# Altium project Mach do dong.PrjPcb
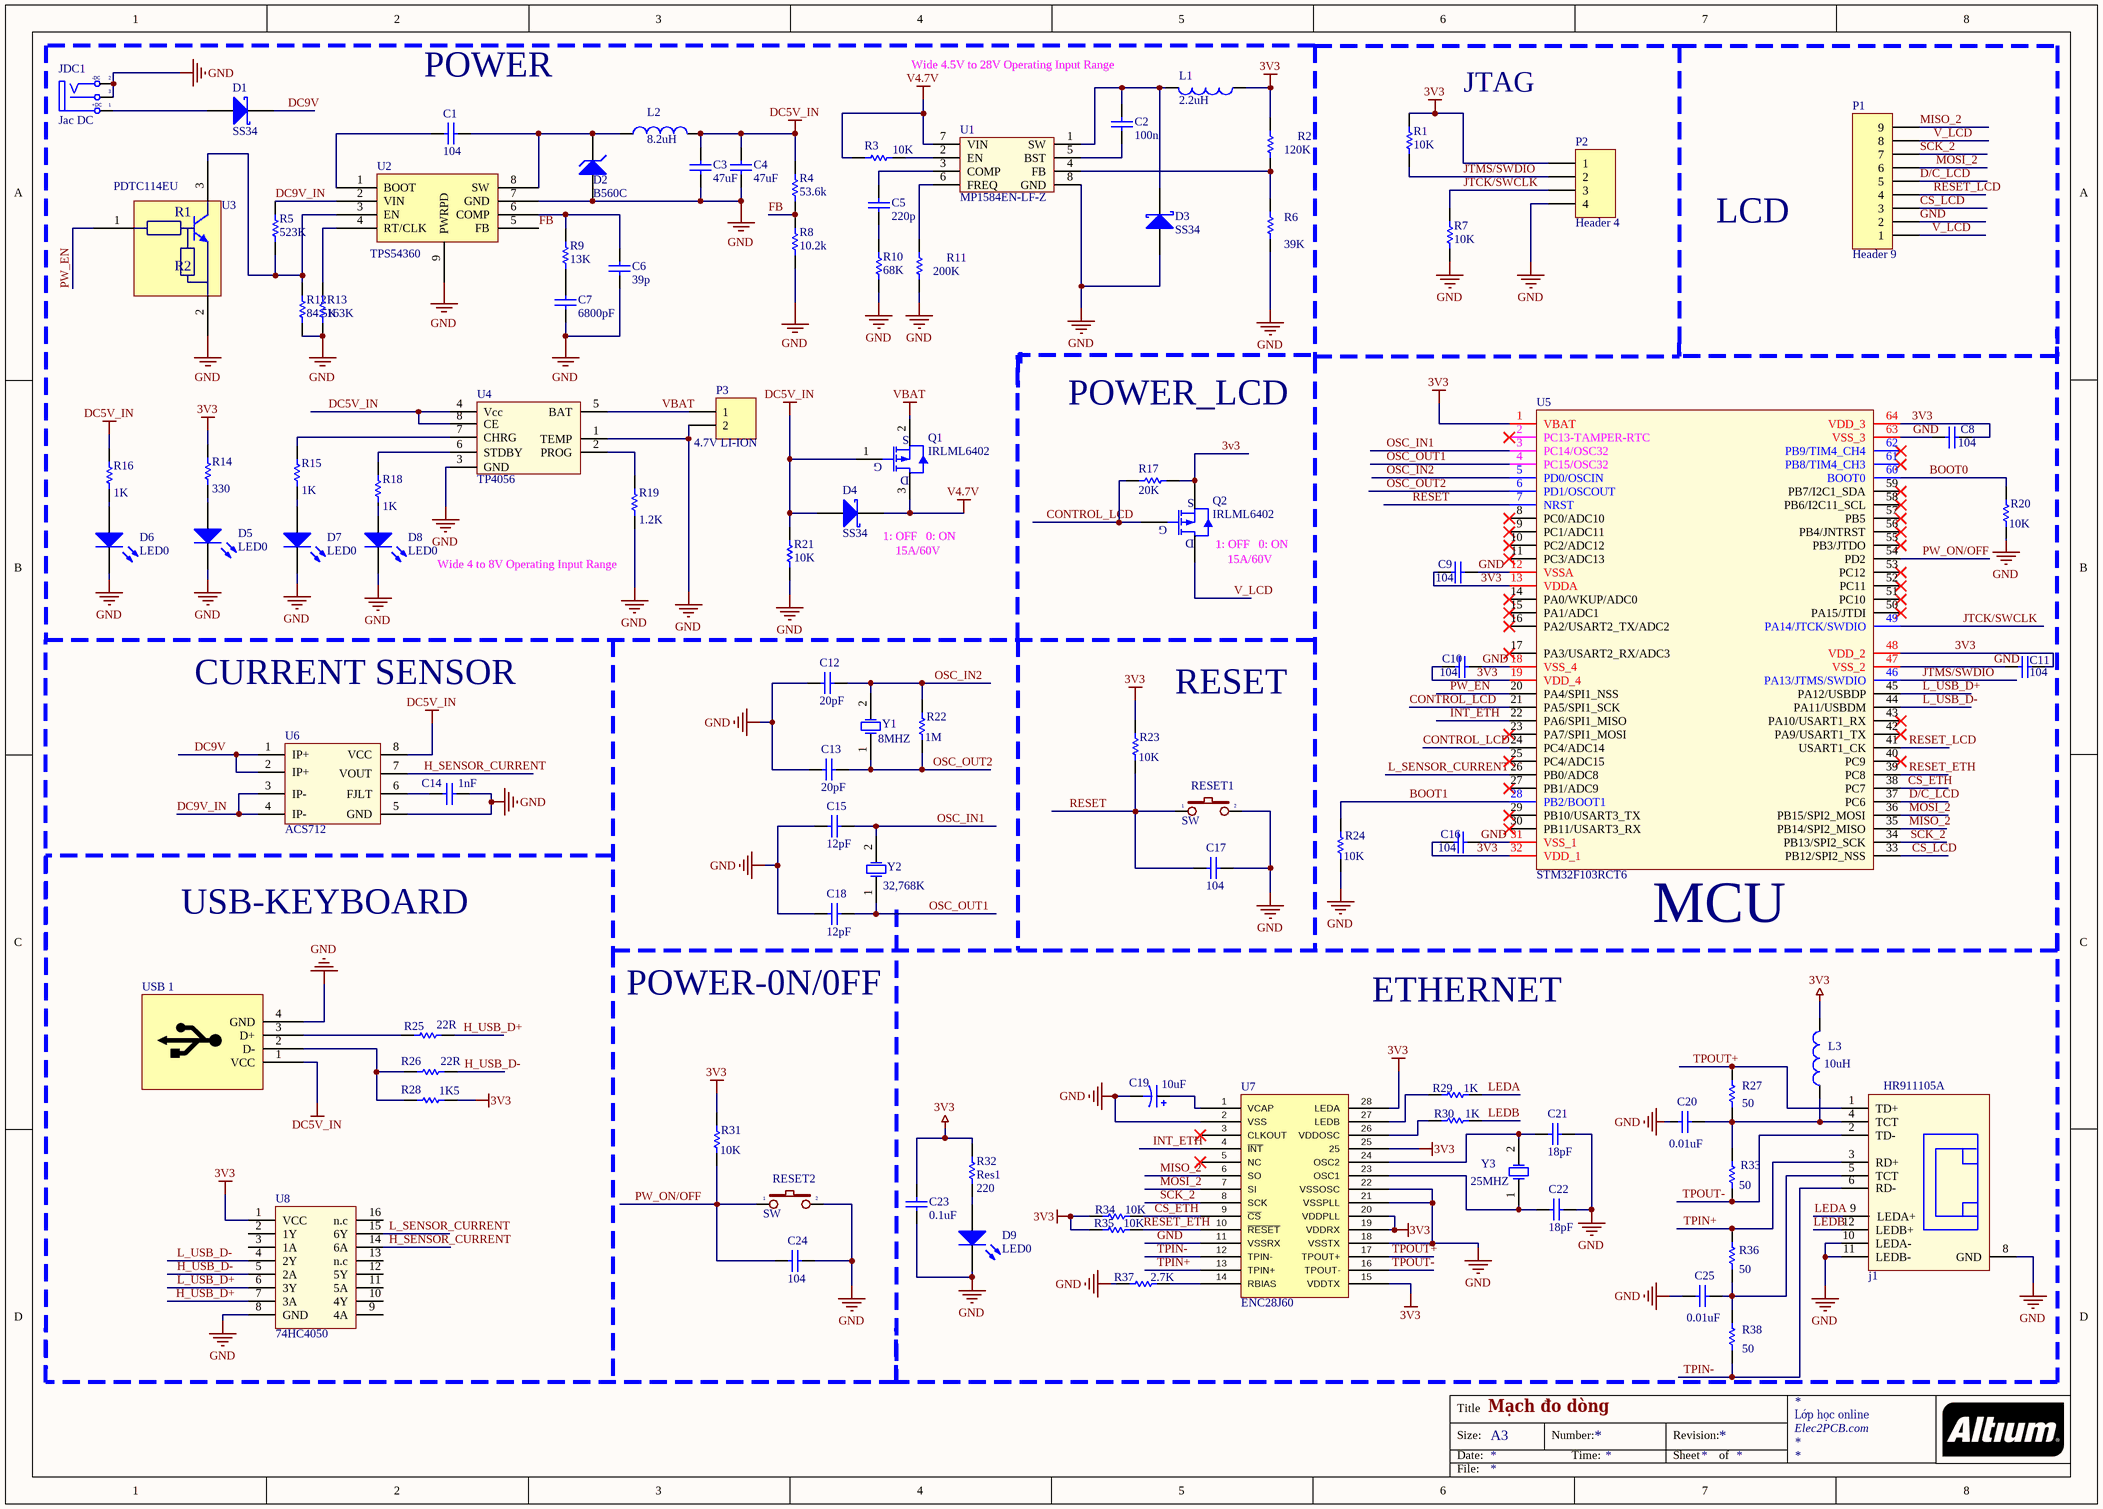
[diagram p0: Mach do dong.schdoc]
1 sheet, 96 parts. Net scope: global (net labels, ports and power ports of the same name join across sheets).
Board file: Mach do dong unroute.PcbDoc

## Sheet Mach do dong.schdoc: Mạch đo dòng
size A3; Address1: Lớp học online; Address2: Elec2PCB.com

### Parts
C1  value 104  [RESC2012(0805)]  (hidden comment: Cap)
C2  value 100n  [C0805-2012]  (hidden comment: Cap)
C3  value 47uF  [RESC2012(0805)]  (hidden comment: Cap)
C4  value 47uF  [RESC2012(0805)]  (hidden comment: Cap)
C5  value 220p  [C0805-2012]  (hidden comment: Cap)
C6  value 39p  [RESC2012(0805)]  (hidden comment: Cap)
C7  value 6800pF  [RESC2012(0805)]  (hidden comment: Cap)
C8  value 104  [C0805-2012]  (hidden comment: Cap)
C9  value 104  [C0805-2012]  (hidden comment: Cap)
C10  value 104  [C0805-2012]  (hidden comment: Cap)
C11  value 104  [C0805-2012]  (hidden comment: Cap)
C12  value 20pF  [C0805-2012]  (hidden comment: Cap)
C13  value 20pF  [C0805-2012]  (hidden comment: Cap)
C14  value 1nF  [C0805-2012]  (hidden comment: Cap)
C15  value 12pF  [C0805-2012]  (hidden comment: Cap)
C16  value 104  [C0805-2012]  (hidden comment: Cap)
C17  value 104  [C0805-2012]  (hidden comment: Cap)
C18  value 12pF  [C0805-2012]  (hidden comment: Cap)
C19  value 10uF  [CAP_TANTA_10UF_10V]  (hidden comment: Cap Pol1)
C20  value 0.01uF  [C0805-2012]  (hidden comment: Cap)
C21  value 18pF  [C0805-2012]  (hidden comment: Cap)
C22  value 18pF  [C0805-2012]  (hidden comment: Cap)
C23  value 0.1uF  [C0805-2012]  (hidden comment: Cap)
C24  value 104  [C0805-2012]  (hidden comment: Cap)
C25  value 0.01uF  [C0805-2012]  (hidden comment: Cap)
D1  SS34  [SS14]
D2  B560C  [SS34]
D3  SS34  [SS14]
D4  SS34  [SS14]
D5  LED0  [RESC2012(0805)]
D6  LED0  [RESC2012(0805)]
D7  LED0  [RESC2012(0805)]
D8  LED0  [RESC2012(0805)]
D9  LED0  [RESC2012(0805)]
j1  HR911105A  [HR911105A]
JDC1  Jac DC  [DC-IN]
L1  value 2.2uH  [CD32 - 2.2uH 3.5x3.3MM]  (hidden comment: Inductor)
L2  value 8.2uH  [L-8.2uH CD53 SMD]  (hidden comment: Inductor)
L3  value 10uH  [INDUCTOR_TOKO_1UH]  (hidden comment: Inductor)
P1  Header 9  [CON9]
P2  Header 4  [Header_4]
P3  4.7V LI-ION  [Header_2]
Q1  IRLML6402  [SOT-23_M]
Q2  IRLML6402  [SOT-23_M]
R1  value 10K  [RESC2012(0805)]  (hidden comment: Res1)
R2  value 120K  [RESC2012(0805)]  (hidden comment: Res1)
R3  value 10K  [RESC2012(0805)]  (hidden comment: Res1)
R4  value 53.6k  [RESC2012(0805)]  (hidden comment: Res1)
R5  value 523K  [RESC2012(0805)]  (hidden comment: Res1)
R6  value 39K  [RESC2012(0805)]  (hidden comment: Res1)
R7  value 10K  [RESC2012(0805)]  (hidden comment: Res1)
R8  value 10.2k  [RESC2012(0805)]  (hidden comment: Res1)
R9  value 13K  [RESC2012(0805)]  (hidden comment: Res1)
R10  value 68K  [RESC2012(0805)]  (hidden comment: Res1)
R11  value 200K  [RESC2012(0805)]  (hidden comment: Res1)
R12  value 84.5K  [RESC2012(0805)]  (hidden comment: Res1)
R13  value 163K  [RESC2012(0805)]  (hidden comment: Res1)
R14  value 330  [RESC2012(0805)]  (hidden comment: Res1)
R15  value 1K  [RESC2012(0805)]  (hidden comment: Res1)
R16  value 1K  [RESC2012(0805)]  (hidden comment: Res1)
R17  value 20K  [RESC2012(0805)]  (hidden comment: Res1)
R18  value 1K  [RESC2012(0805)]  (hidden comment: Res1)
R19  value 1.2K  [RESC2012(0805)]  (hidden comment: Res1)
R20  value 10K  [RESC2012(0805)]  (hidden comment: Res1)
R21  10K  [RESC2012(0805)]
R22  value 1M  [RESC2012(0805)]  (hidden comment: Res1)
R23  value 10K  [RESC2012(0805)]  (hidden comment: Res1)
R24  value 10K  [RESC2012(0805)]  (hidden comment: Res1)
R25  value 22R  [RESC2012(0805)]  (hidden comment: Res1)
R26  value 22R  [RESC2012(0805)]  (hidden comment: Res1)
R27  value 50  [RESC2012(0805)]  (hidden comment: Res1)
R28  value 1K5  [RESC2012(0805)]  (hidden comment: Res1)
R29  value 1K  [RESC2012(0805)]  (hidden comment: Res1)
R30  value 1K  [RESC2012(0805)]  (hidden comment: Res1)
R31  value 10K  [RESC2012(0805)]  (hidden comment: Res1)
R32  Res1  value 220  [RESC2012(0805)]
R33  value 50  [RESC2012(0805)]  (hidden comment: Res1)
R34  value 10K  [RESC2012(0805)]  (hidden comment: Res1)
R35  value 10K  [RESC2012(0805)]  (hidden comment: Res1)
R36  value 50  [RESC2012(0805)]  (hidden comment: Res1)
R37  value 2.7K  [RESC2012(0805)]  (hidden comment: Res1)
R38  value 50  [RESC2012(0805)]  (hidden comment: Res1)
RESET1  SW  [SW-SMD]
RESET2  SW  [SW-SMD]
U1  MP1584EN-LF-Z  [MP1584EN-LF-Z]
U2  TPS54360  [TPS54360]
U3  PDTC114EU  [SOT-23_M]
U4  TP4056  [SO-8]
U5  STM32F103RCT6  [LQFP64_M]
U6  ACS712  [SO-8]
U7  ENC28J60  [SOL-28]
U8  74HC4050  [SO-16]
USB_1  USB  [USB type A female]  (value not drawn)
Y1  8MHZ  [Xtal-smd]
Y2  32,768K  [CR_32768]
Y3  25MHZ  [Xtal-smd]

### Nets
3V3: C8.2 C9.1 C10.1 C11.2 C16.1 C23.2 L1.1 L3.2 P2.1 Q2.2(S) R1.1 R2.1 R14.2 R17.2 R23.2 R28.1 R31.2 R32.2 R34.2 R35.2 U5.1(VBAT) U5.13(VDDA) U5.19(VDD_4) U5.32(VDD_1) U5.48(VDD_2) U5.64(VDD_3) U7.15(VDDTX) U7.19(VDDRX) U7.20(VDDPLL) U7.25 U7.28(LEDA) U8.1(VCC)
DC5V_IN: C3.1 C4.1 D4.1(A) L2.2 Q1.1(G) R4.2 R16.2 R21.1 U4.4(Vcc) U4.8(CE) U6.8(VCC) USB_1.1(VCC)
GND: C3.2 C4.2 C6.2 C7.2 C8.1 C9.2 C10.2 C11.1 C12.1 C13.1 C14.2 C15.1 C16.2 C17.2 C18.1 C19.2 C20.1 C21.1 C22.1 C23.1 C24.2 C25.1 D2.1(A) D3.1(A) D5.2(K) D6.2(K) D7.2(K) D8.2(K) D9.2(K) j1.8(GND) j1.10(LEDA-) j1.11(LEDB-) JDC1.2(TN) JDC1.3(S) P1.2 P2.4 P3.2 R6.2 R7.2 R8.1 R10.2 R11.2 R12.1 R13.1 R19.1 R20.1 R21.2 R24.1 R37.2 RESET1.2 RESET2.2 U1.8(GND) U2.7(GND) U2.9(PWRPD) U3.2(GND) U4.1(TEMP) U4.3(GND) U5.12(VSSA) U5.18(VSS_4) U5.31(VSS_1) U5.47(VSS_2) U5.63(VSS_3) U6.5(GND) U7.2(VSS) U7.11(VSSRX) U7.18(VSSTX) U7.21(VSSPLL) U7.22(VSSOSC) U8.8(GND) USB_1.4(GND)
V4.7V: D4.2(K) Q1.3(D) R3.2 U1.7(VIN)
VBAT: P3.1 Q1.2(S) U4.5(BAT)
BOOT0: R20.2 U5.60(BOOT0)
BOOT1: R24.2 U5.28(PB2/BOOT1)
CONTROL_LCD: Q2.1(G) R17.1 U5.21(PA5/SPI1_SCK) U5.24(PC4/ADC14)
CS_ETH: R34.1 U5.38(PC7) U7.9(~{CS})
CS_LCD: P1.3 U5.33(PB12/SPI2_NSS)
D/C_LCD: P1.5 U5.37(PC6)
DC9V: D1.2(K) U6.1(IP+) U6.2(IP+)
DC9V_IN: R5.2 U2.2(VIN) U6.3(IP-) U6.4(IP-)
FB: R4.1 R8.2 U2.5(FB)
H_SENSOR_CURRENT: U6.7(VOUT) U8.14(6A)
H_USB_D+: R25.1 U8.7(3A)
H_USB_D-: R26.1 U8.5(2A)
INT_ETH: U5.22(PA6/SPI1_MISO) U7.4(~{INT})
JTCK/SWCLK: P2.3 R7.1 U5.49(PA14/JTCK/SWDIO)
JTMS/SWDIO: P2.2 R1.2 U5.46(PA13/JTMS/SWDIO)
L_SENSOR_CURRENT: U5.26(PB0/ADC8) U8.15(6Y)
L_USB_D+: U5.45(PA12/USBDP) U8.6(3Y)
L_USB_D-: U5.44(PA11/USBDM) U8.4(2Y)
LEDA: j1.9(LEDA+) R29.1
LEDB: j1.12(LEDB+) R30.1
MISO_2: P1.9 U5.35(PB14/SPI2_MISO) U7.6(SO)
MOSI_2: P1.6 U5.36(PB15/SPI2_MOSI) U7.7(SI)
OSC_IN1: C15.2 U5.3(PC14/OSC32) Y2.2(OSC2)
OSC_IN2: C12.2 R22.2 U5.5(PD0/OSCIN) Y1.2(OSC2)
OSC_OUT1: C18.2 U5.4(PC15/OSC32) Y2.1(OSC1)
OSC_OUT2: C13.2 R22.1 U5.6(PD1/OSCOUT) Y1.1(OSC1)
PW_EN: U3.1(input) U5.20(PA4/SPI1_NSS)
PW_ON/OFF: C24.1 R31.1 RESET2.1 U5.54(PD2)
RESET: C17.1 R23.1 RESET1.1 U5.7(NRST)
RESET_ETH: R35.1 U5.39(PC8) U7.10(~{RESET})
RESET_LCD: P1.4 U5.41(USART1_CK)
SCK_2: P1.7 U5.34(PB13/SPI2_SCK) U7.8(SCK)
TPIN+: j1.3(RD+) R36.2 U7.13(TPIN+)
TPIN-: j1.6(RD-) R38.1 U7.12(TPIN-)
TPOUT+: j1.1(TD+) R27.2 U7.17(TPOUT+)
TPOUT-: j1.2(TD-) R33.1 U7.16(TPOUT-)
V_LCD: P1.1 P1.8 Q2.3(D)
NetC1_1: C1.1 D2.2(K) L2.1 U2.8(SW)
NetC1_2: C1.2 U2.1(BOOT)
NetC2_1: C2.1 U1.5(BST)
NetC2_2: C2.2 D3.2(K) L1.2 U1.1(SW)
NetC5_1: C5.1 U1.3(COMP)
NetC5_2: C5.2 R10.1
NetC6_1: C6.1 R9.2 U2.6(COMP)
NetC7_1: C7.1 R9.1
NetC14_1: C14.1 U6.6(FJLT)
NetC19_1: C19.1 U7.1(VCAP)
NetC20_2: C20.2 j1.4(TCT) L3.1 R27.1 R33.2
NetC21_2: C21.2 U7.24(OSC2) Y3.2(OSC2)
NetC22_2: C22.2 U7.23(OSC1) Y3.1(OSC1)
NetC25_2: C25.2 j1.5(TCT) R36.1 R38.2
NetD1_1: D1.1(A) JDC1.1(T)
NetD5_1: D5.1(A) R14.1
NetD6_1: D6.1(A) R16.1
NetD7_1: D7.1(A) R15.1
NetD8_1: D8.1(A) R18.1
NetD9_1: D9.1(A) R32.1
NetR2_2: R2.2 R6.1 U1.4(FB)
NetR3_1: R3.1 U1.2(EN)
NetR5_1: R5.1 R12.2 U2.3(EN) U3.3(output)
NetR11_1: R11.1 U1.6(FREQ)
NetR13_2: R13.2 U2.4(RT/CLK)
NetR15_2: R15.2 U4.7(CHRG)
NetR18_2: R18.2 U4.6(STDBY)
NetR19_2: R19.2 U4.2(PROG)
NetR25_2: R25.2 USB_1.3(D+)
NetR26_2: R26.2 R28.2 USB_1.2(D-)
NetR29_2: R29.2 U7.27(LEDB)
NetR30_2: R30.2 U7.26(VDDOSC)
NetR37_1: R37.1 U7.14(RBIAS)

Not connected (* = marked no-connect by the designer): U5 2(PC13-TAMPER-RTC)* 8(PC0/ADC10)* 9(PC1/ADC11)* 10(PC2/ADC12)* 11(PC3/ADC13)* 14(PA0/WKUP/ADC0)* 15(PA1/ADC1)* 16(PA2/USART2_TX/ADC2)* 17(PA3/USART2_RX/ADC3)* 23(PA7/SPI1_MOSI)* 25(PC4/ADC15)* 27(PB1/ADC9)* 29(PB10/USART3_TX)* 30(PB11/USART3_RX)* 40(PC9)* 42(PA9/USART1_TX)* 43(PA10/USART1_RX)* 50(PA15/JTDI)* 51(PC10)* 52(PC11)* 53(PC12)* 55(PB3/JTDO)* 56(PB4/JNTRST)* 57(PB5)* 58(PB6/I2C11_SCL)* 59(PB7/I2C1_SDA)* 61(PB8/TIM4_CH3)* 62(PB9/TIM4_CH4)*; U7 3(CLKOUT)* 5(NC)*; U8 2(1Y) 3(1A) 9(4A) 10(4Y) 11(5A) 12(5Y) 13(n.c) 16(n.c); USB_1 5 6

### Notes on the sheet
- (near C1) POWER
- Wide 4.5V to 28V Operating Input Range
- JTAG
- LCD
- POWER_LCD
- Wide 4 to 8V Operating Input Range
- (near D4) 1: OFF   0: ON
- 15A/60V
- (near Q2) 1: OFF   0: ON
- (near Q2) 15A/60V
- CURRENT SENSOR
- (near R23) RESET
- USB-KEYBOARD
- (near U5) MCU
- (near C18) POWER-0N/0FF
- ETHERNET
- Title
- Size:
- Date:
- A3
- Number:
- Time:
- Revision:
- Sheet
- of
- File:
- (in symbol DCIN) -DC; +DC
- (in symbol PDTC114EU) R1; R2

### Library data of the parts
C1-C18 C20-C25 = Cap: Capacitor; Published: 8-Jun-2000; LatestRevisionDate: 17-Jul-2002; LatestRevisionNote: Re-released for DXP Platform.; PackageReference: RAD-0.3; Publisher: Altium Limited
  C2 C5 C8-C18 C20-C25: PackageDescription: Radial Cap, Thru-Hole; 2 Leads; 0.3 in Pin Spacing
C19 = Cap Pol1: Polarized Capacitor (Radial); Published: 8-Jun-2000; LatestRevisionDate: 17-Jul-2002; LatestRevisionNote: Re-released for DXP Platform.; PackageReference: RB7.6-15; Publisher: Altium Limited; PackageDescription: Polarized Capacitor (Radial); 2 Leads
D1 D3 D4 = D Schottky: Schottky Diode; Published: 8-Jun-2000; LatestRevisionDate: 17-Jul-2002; LatestRevisionNote: Re-released for DXP Platform.; PackageReference: SMB; Publisher: Altium Limited; PackageDescription: DO-214-AA/SMB; 2 C-Bend Leads; Body 5.3 x 3.6 mm, inc. leads (LxW); Code_JEDEC: DO-214-AA
D2 = D Zener: Zener Diode; Published: 8-Jun-2000; LatestRevisionDate: 17-Jul-2002; LatestRevisionNote: Re-released for DXP Platform.; PackageReference: DIODE-0.7; Publisher: Altium Limited
D5-D9 = LED0: Typical INFRARED GaAs LED; Published: 8-Jun-2000; LatestRevisionDate: 08-Jul-2005; LatestRevisionNote: Mech Layer 1 removed.; PackageReference: LED-0; Publisher: Altium Limited; PackageDescription: LED; 2 Leads
j1 = HR911105A: Ethernet Connector
JDC1 = DCIN: Jac DC input; Value: Jac DC
L1-L3 = Inductor: Code_IEC: 1005; Published: 8-Jun-2000; LatestRevisionDate: 29-May-2009; LatestRevisionNote: IPC-7351 Footprint Added.; PackageReference: 0402-A; Publisher: Altium Limited; PackageDescription: Chip Inductor; Code_JEITA: 0402
P1 = Header 9: Header, 9-Pin; LatestRevisionDate: 17-Jul-2002; LatestRevisionNote: Re-released for DXP Platform.; Publisher: Altium Limited
P2 = Header 4: Header, 4-Pin; LatestRevisionDate: 17-Jul-2002; LatestRevisionNote: Re-released for DXP Platform.; Publisher: Altium Limited
P3 = Header 2: Header, 2-Pin; LatestRevisionDate: 17-Jul-2002; LatestRevisionNote: Re-released for DXP Platform.; Publisher: Altium Limited
Q1 Q2 = 8#IRLML9301TRPBF: MOSFET MOSFT P-Ch -60V -15A; Manufacturer: International Rectifier; Rds On Max: 64mR; Input Capacitance: 388pF; Rise Time: 19ns; Recovery Time: 21ns; Nominal Vgs: -1.3V; Number of Elements: 1; Max Power Dissipation: 1.3W; Drain to Source Voltage (Vdss): 30V; Continuous Drain Current (ID): 3.6A; Gate to Source Voltage (Vgs): 20V; Drain to Source Resistance: 103mR; Turn-On Delay Time: 9.6ns; Turn-Off Delay Time: 16ns; Fall Time: 15ns; Element Configuration: Single; Drain to Source Breakdown Voltage: -30V; Manufacturer Part Number: IRLML9301TRPBF; Mount: Surface Mount; Case/Package: SOT-23; Number of Pins: 3; Min Operating Temperature: -55°C; Max Operating Temperature: 150°C; Packaging: Tape and Reel; Package Quantity: 1; Power Dissipation: 1.3W; Threshold Voltage: -1.3V; On-State Resistance: 64MR; Length: 3.04mm; Height: 1.02mm; Width: 1.4mm; Radiation Hardening: No; REACH SVHC: No SVHC; Lead Free: Lead Free; Supplier 1: Farnell; Supplier Part Number 1: 1829137
R1-R20 R22-R38 = Res1: Resistor; Published: 8-Jun-2000; LatestRevisionDate: 17-Jul-2002; LatestRevisionNote: Re-released for DXP Platform.; PackageReference: AXIAL-0.3; Publisher: Altium Limited
  R1-R3 R6 R7 R10 R11 R14-R20 R22-R38: PackageDescription: Axial Device, Thru-Hole; 2 Leads; 0.3 in Pin Spacing
R21 = 10K/R0603/1%: RES SMD 10K OHM 1% 1/10W 0603; Manufacturer: Yageo; Manufacturer Part Number: RC0603FR-0710KL; Power (Watts): 0.1W, 1/10W; Temperature Coefficient: ±100ppm/°C; Supplier 1: Digi-Key; RoHS: RoHS Compliant; Category: Resistors; Stock 1: 11440000; Pricing 1: 5000=0.00167, 10000=0.00145, 25000=0.00128, 50000=0.00117, 125000=0.00115 (USD); Packaging: Tape & Reel (TR); Resistance (Ohms): 10k; Tolerance: ±1%; Composition: Thick Film; Features: Moisture Resistant; Operating Temperature: -55°C ~ 155°C; Package / Case: 0603 (1608 Metric); Supplier Device Package: 0603; Size / Dimension: 0.063" L x 0.031" W (1.60mm x 0.80mm); Height: 0.022" (0.55mm); Number of Terminations: 2; ComponentLink1URL: http://www.yageo.com/NewPortal/yageodocoutput?fileName=/pdf/R-Chip/PYu-RC_Group_51_RoHS_L_3.pdf; ComponentLink1Description: http://www.yageo.com/NewPortal/yageodocoutput?fileName=/pdf/R-Chip/PYu-RC_Group_51_RoHS_L_3.pdf; Supplier Part Number 1: 311-10.0KHRTR-ND
RESET1 RESET2 = SW2: Switch button 2 pin; Value: SW chip 2 pin
U1 = MP1584EN-LF-Z: 3A, 1.5HZ, 28V Step-Down Converter
U6 = ACS712: Current Sensor
U7 = ENC28J60: Stand-Alone Ethernet Controller with SPI Interface
U8 = 74HC4050: 74HC4050 Non-Inv Hex Logic Down Coverter
USB_1 = USB_MH: USB conector
Y1-Y3 = XTAL: Crystal Oscillator; Published: 8-Jun-2000; LatestRevisionDate: 17-Jul-2002; LatestRevisionNote: Re-released for DXP Platform.; PackageReference: R38; Publisher: Altium Limited; PackageDescription: Crystal, Thru-Hole; 2 Leads; Body 3.1 x 8.2 mm (Dia.xH)